# Altium schematic sheet RX_Pre.SchDoc: Ararinha 6F
size A4; Revision: 1.0; SheetNumber: 4; SheetTotal: 7
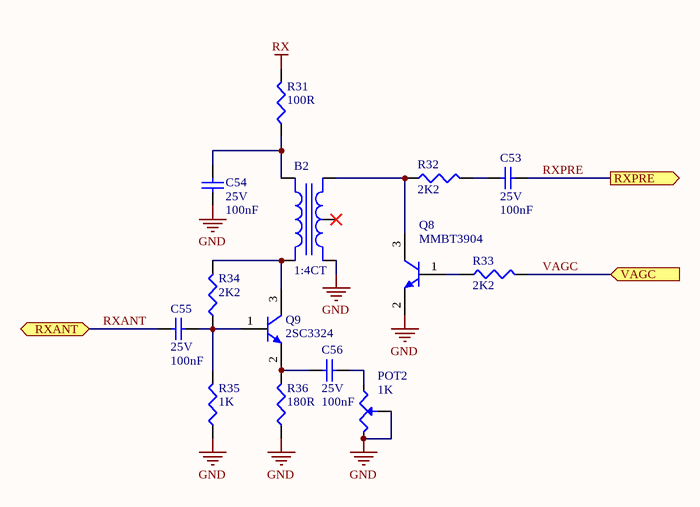
[diagram p0: RX_Pre.SchDoc]

## Parts
B2  1:4CT  [CX2047LANL]
C53  value 100nF  Tensão: 25V  [CC0603]  (hidden comment: Capacitor Cerâmico)
C54  value 100nF  Tensão: 25V  [CC0603]  (hidden comment: Capacitor Cerâmico)
C55  value 100nF  Tensão: 25V  [CC0603]  (hidden comment: Capacitor Cerâmico)
C56  value 100nF  Tensão: 25V  [CC0603]  (hidden comment: Capacitor Cerâmico)
POT2  value 1K  [POT - PTV09]  (hidden comment: Potenciômetro)
Q8  MMBT3904  [SOT-23-3N]
Q9  2SC3324  [SOT-23-3N]
R31  value 100R  [CC0603]  (hidden comment: Resistor)
R32  value 2K2  [CC0603]  (hidden comment: Resistor)
R33  value 2K2  [CC0603]  (hidden comment: Resistor)
R34  value 2K2  [CC0603]  (hidden comment: Resistor)
R35  value 1K  [CC0603]  (hidden comment: Resistor)
R36  value 180R  [CC0603]  (hidden comment: Resistor)

## Ports
RXANT (bidir), RXPRE (out), VAGC (in)

## Nets
GND: B2.3(Pri-) C54.1 POT2.2(TAP) POT2.3 Q8.2(E) R35.1 R36.1
RX: R31.2
RXANT: C55.2 ; port RXANT
RXPRE: C53.1 ; port RXPRE
VAGC: R33.2 ; port VAGC
NetB2_1: B2.1(Sec+) Q8.3(C) R32.1
NetB2_4: B2.4(Pri+) Q9.3(C) R34.2
NetB2_6: B2.6(Sec-) C54.2 R31.1
NetC53_2: C53.2 R32.2
NetC55_1: C55.1 Q9.1(B) R34.1 R35.2
NetC56_1: C56.1 POT2.1
NetC56_2: C56.2 Q9.2(E) R36.2
NetQ8_1: Q8.1(B) R33.1

Not connected (* = marked no-connect by the designer): B2 2(Sec+)*

## Notes on the sheet
- Projeto:
- Tamanho:
- Data:
- A4
- Eng. Felipe Navarro
- Hora:
- Revisão:
- Folha
- de
- Arquivo:

## Library data of the parts
B2 = BALUN CX2047LANL: Balun 4CT:1; ChinesePrice: 0,00000; Chinês: ----; Corrente: *; Potência: *; Supplier 1: Digi-Key; Supplier Part Number 1: 553-2770-1-ND; Tensão: *; Obs:: *; Tolerância: *; ComponentLink1Description: Datasheet; ComponentLink1URL: D:\Tecnoclade\Datasheet\!DataMissing.pdf; Substituição: 00/00/0000; Value: *
C53-C56 = Cap 100nF 25V 0603 X7R: Capacitor (Semiconductor SIM Model); Chinês: Local; ChinesePrice: 0,00246; Corrente: *A; Potência: *W; Obs:: X7R; Tolerância: ±10%; Supplier 1: Digi-Key; Supplier Part Number 1: 490-1524-1-ND; ComponentLink1Description: Datasheet; ComponentLink1URL: D:\Tecnoclade\Datasheet\!DataMissing.pdf
POT2 = POT 100k Audio: Potenciometro; ChinesePrice: 0,00000; Chinês: ----; Corrente: *A; Potência: *W; Tensão: *V; Tolerância: ±*%; Supplier 1: Digi-Key; Supplier Part Number 1: PTV09A-2020F-B102-ND; Obs: *; ComponentLink1Description: Datasheet; ComponentLink1URL: D:\Tecnoclade\Datasheet\!DataMissing.pdf
Q8 = TRS MMBT3904 40V 200mA SOT-23-3N: NPN General Purpose Amplifier; Tensão: 40V; Corrente: 600mA; Potência: 350mW; Chinês: ----; ChinesePrice: 0,00000; Value: 300MHz; Supplier 1: Digi-Key; Supplier Part Number 1: 568-4510-1-ND; Obs:: *; Tolerância: *; ComponentLink1Description: Datasheet; ComponentLink1URL: D:\Tecnoclade\Datasheet\!DataMissing.pdf
Q9 = TRS 2SC3324 120V 100mA SOT-23-3: NPN General Purpose Amplifier; Tensão: 40V; Corrente: 600mA; Potência: 350mW; Chinês: ----; ChinesePrice: 0,00000; Value: 300MHz; Supplier 1: Digi-Key; Supplier Part Number 1: 2SC3324-BL(TE85LFCT-ND; Obs:: *; Tolerância: *; ComponentLink1Description: Datasheet; ComponentLink1URL: D:\Tecnoclade\Datasheet\!DataMissing.pdf
R31 = Res 100R 5% 0603 1/10W: ChinesePrice: 0,00080; Chinês: Local; Corrente: *A; Potência: 1/10W; Tensão: *V; Tolerância: ±5%; Supplier 1: Digi-Key; Supplier Part Number 1: RMCF0603JT100RCT-ND; Obs: *; ComponentLink1Description: Datasheet; ComponentLink1URL: D:\Tecnoclade\Datasheet\!DataMissing.pdf
R32-R34 = Res 2K2 5% 0603 1/10W: ChinesePrice: 0,00000; Chinês: ----; Corrente: *A; Potência: 1/10W; Tensão: *V; Obs: ±200ºC/ppm; Tolerância: ±5%; Supplier 1: Digi-Key; Supplier Part Number 1: RMCF0603JT2K20CT-ND; ComponentLink1Description: Datasheet; ComponentLink1URL: D:\Tecnoclade\Datasheet\!DataMissing.pdf
R35 = Res 1K 1% 0603 1/10W: ChinesePrice: 0,00089; Chinês: Local; Corrente: *A; Potência: 1/10W; Tensão: *V; Tolerância: ±1%; Supplier 1: Digi-Key; Supplier Part Number 1: RMCF0603FT1K00CT-ND; Obs: *; ComponentLink1Description: Datasheet; ComponentLink1URL: D:\Tecnoclade\Datasheet\!DataMissing.pdf
R36 = Res 180R 1% 0603 1/10W: ChinesePrice: 0,00000; Chinês: -----; Corrente: *A; Potência: 1/10W; Tensão: *V; Obs: ±100ppm/ºC; Tolerância: ±1%; Supplier 1: Digi-Key; Supplier Part Number 1: RMCF0603FT180RCT-ND; ComponentLink1Description: Datasheet; ComponentLink1URL: D:\Tecnoclade\Datasheet\!DataMissing.pdf